# EasyEDA schematic FD-01 MK3.json
TITLE: Sheet_1; REV: 1.0; Date: 2020-09-08; Sheet: 1/1; Company: Your Company
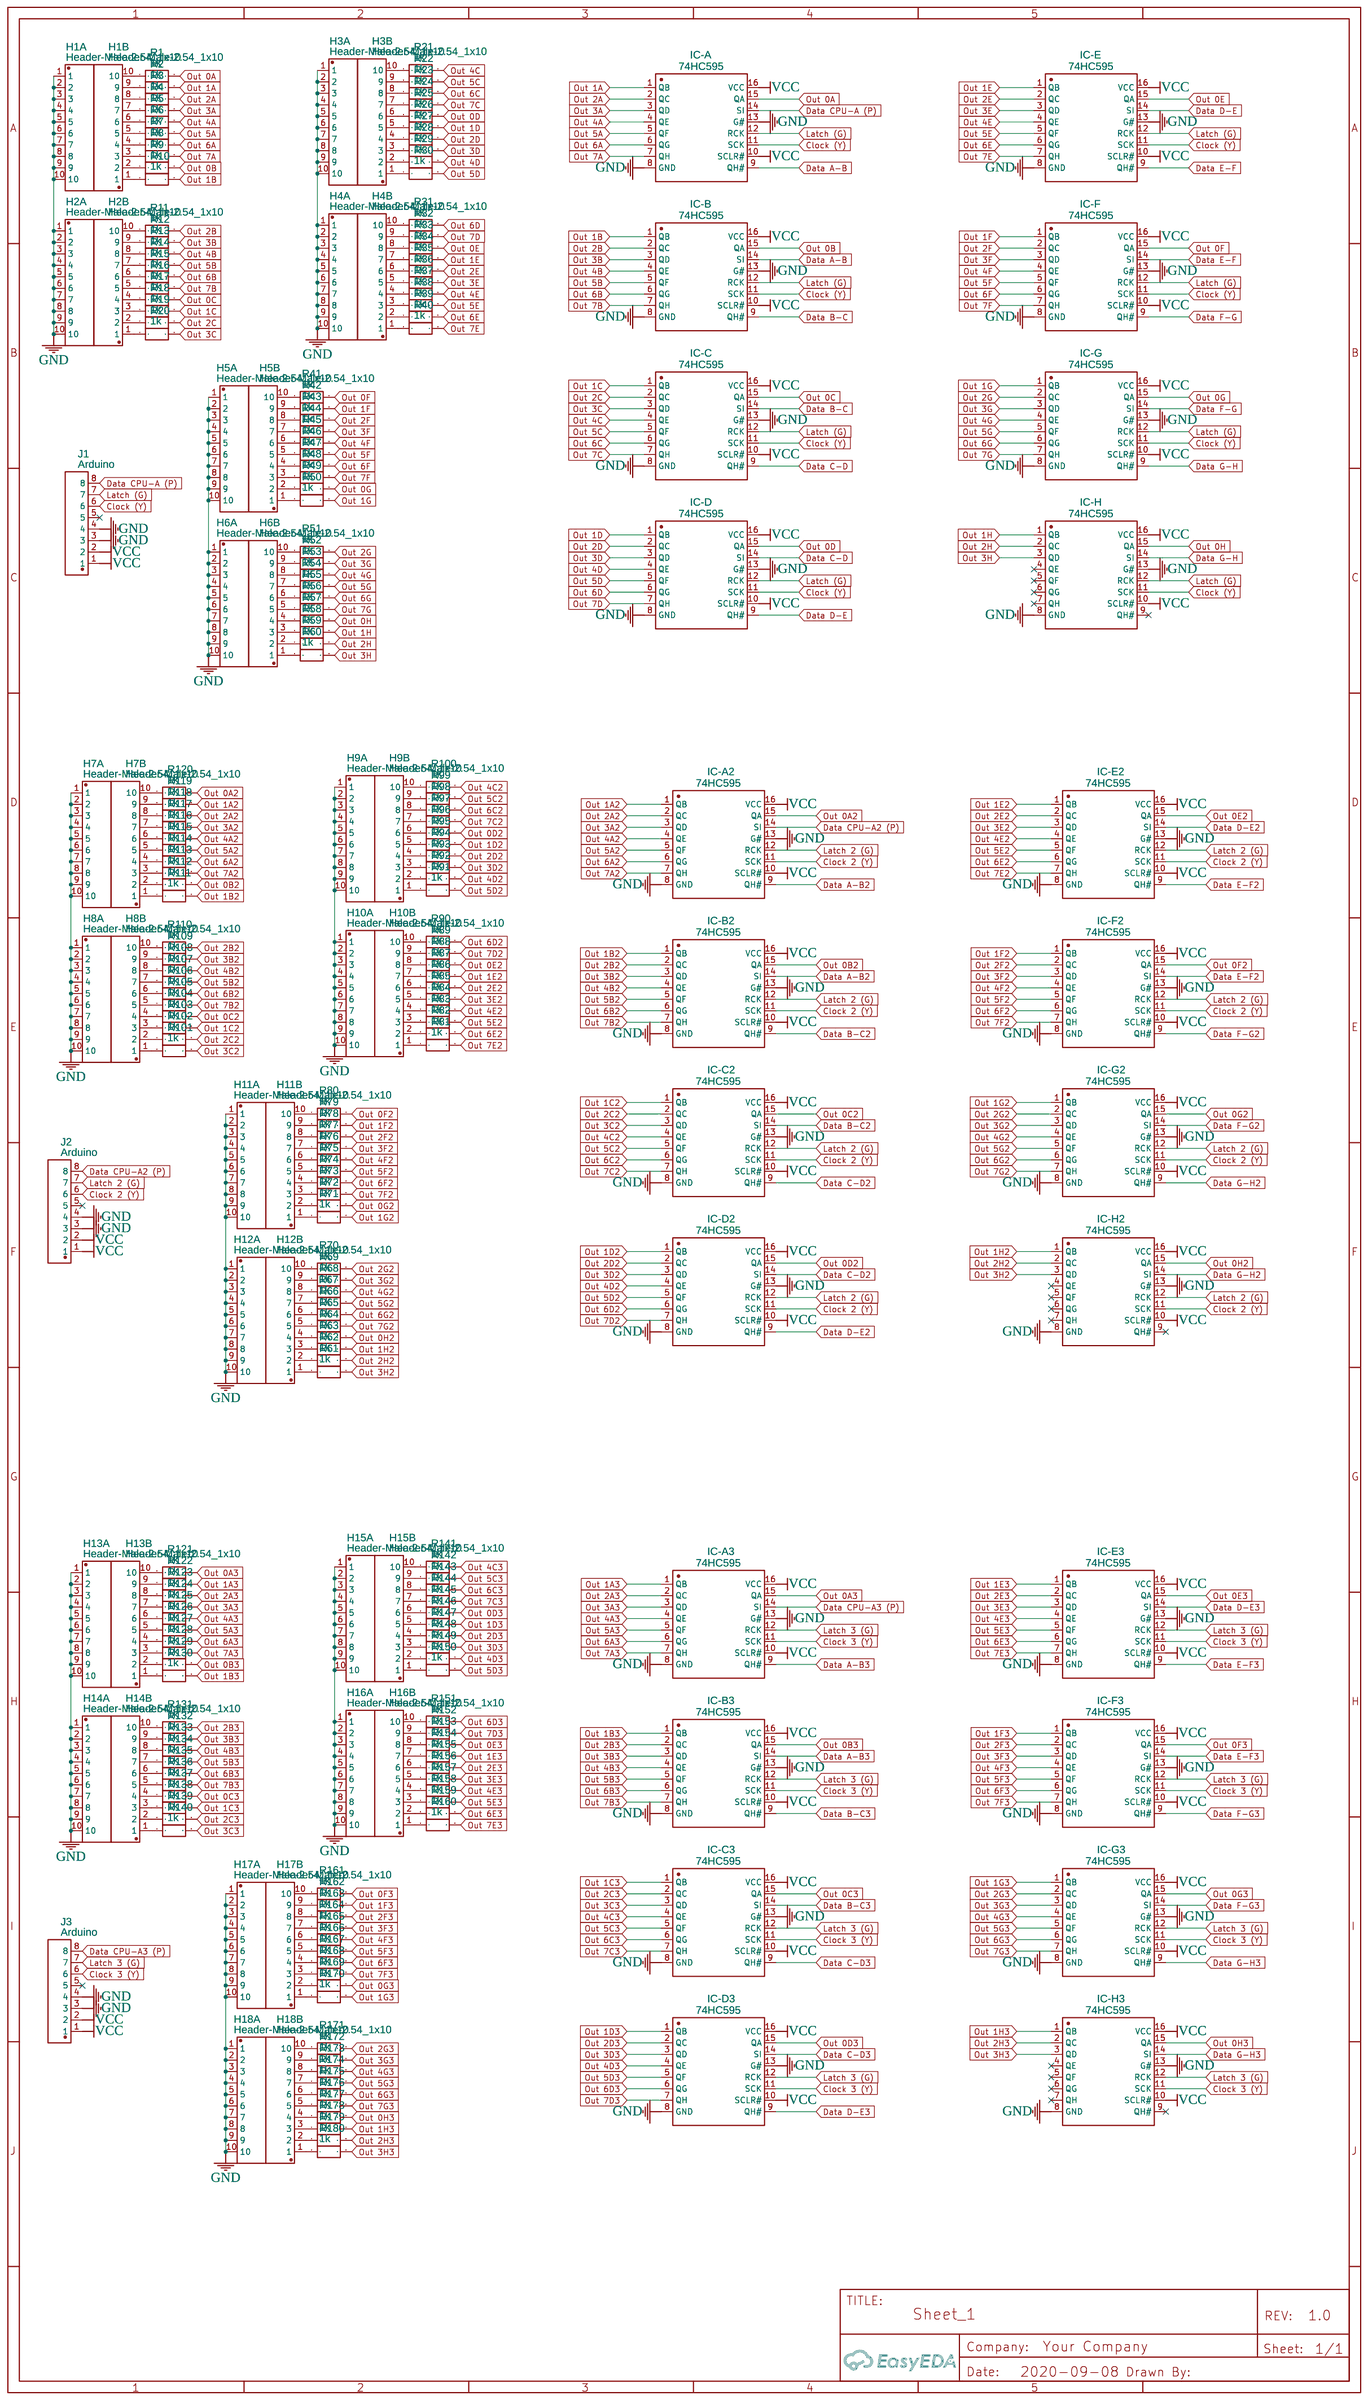
[diagram p0: schematic sheet]

## Parts
H1A  Header-Male-2.54_1x10  [HDR-TH_10P-P2.54-V]
H1B  Header-Male-2.54_1x10  [HDR-TH_10P-P2.54-V]
H2A  Header-Male-2.54_1x10  [HDR-TH_10P-P2.54-V]
H2B  Header-Male-2.54_1x10  [HDR-TH_10P-P2.54-V]
H3A  Header-Male-2.54_1x10  [HDR-TH_10P-P2.54-V]
H3B  Header-Male-2.54_1x10  [HDR-TH_10P-P2.54-V]
H4A  Header-Male-2.54_1x10  [HDR-TH_10P-P2.54-V]
H4B  Header-Male-2.54_1x10  [HDR-TH_10P-P2.54-V]
H5A  Header-Male-2.54_1x10  [HDR-TH_10P-P2.54-V]
H5B  Header-Male-2.54_1x10  [HDR-TH_10P-P2.54-V]
H6A  Header-Male-2.54_1x10  [HDR-TH_10P-P2.54-V]
H6B  Header-Male-2.54_1x10  [HDR-TH_10P-P2.54-V]
H7A  Header-Male-2.54_1x10  [HDR-TH_10P-P2.54-V]
H7B  Header-Male-2.54_1x10  [HDR-TH_10P-P2.54-V]
H8A  Header-Male-2.54_1x10  [HDR-TH_10P-P2.54-V]
H8B  Header-Male-2.54_1x10  [HDR-TH_10P-P2.54-V]
H9A  Header-Male-2.54_1x10  [HDR-TH_10P-P2.54-V]
H9B  Header-Male-2.54_1x10  [HDR-TH_10P-P2.54-V]
H10A  Header-Male-2.54_1x10  [HDR-TH_10P-P2.54-V]
H10B  Header-Male-2.54_1x10  [HDR-TH_10P-P2.54-V]
H11A  Header-Male-2.54_1x10  [HDR-TH_10P-P2.54-V]
H11B  Header-Male-2.54_1x10  [HDR-TH_10P-P2.54-V]
H12A  Header-Male-2.54_1x10  [HDR-TH_10P-P2.54-V]
H12B  Header-Male-2.54_1x10  [HDR-TH_10P-P2.54-V]
H13A  Header-Male-2.54_1x10  [HDR-TH_10P-P2.54-V]
H13B  Header-Male-2.54_1x10  [HDR-TH_10P-P2.54-V]
H14A  Header-Male-2.54_1x10  [HDR-TH_10P-P2.54-V]
H14B  Header-Male-2.54_1x10  [HDR-TH_10P-P2.54-V]
H15A  Header-Male-2.54_1x10  [HDR-TH_10P-P2.54-V]
H15B  Header-Male-2.54_1x10  [HDR-TH_10P-P2.54-V]
H16A  Header-Male-2.54_1x10  [HDR-TH_10P-P2.54-V]
H16B  Header-Male-2.54_1x10  [HDR-TH_10P-P2.54-V]
H17A  Header-Male-2.54_1x10  [HDR-TH_10P-P2.54-V]
H17B  Header-Male-2.54_1x10  [HDR-TH_10P-P2.54-V]
H18A  Header-Male-2.54_1x10  [HDR-TH_10P-P2.54-V]
H18B  Header-Male-2.54_1x10  [HDR-TH_10P-P2.54-V]
IC-A  74HC595  [SOIC-16_L9.9-W3.9-P1.27-LS6.0-BL]
IC-A2  74HC595  [SOIC-16_L9.9-W3.9-P1.27-LS6.0-BL]
IC-A3  74HC595  [SOIC-16_L9.9-W3.9-P1.27-LS6.0-BL]
IC-B  74HC595  [SOIC-16_L9.9-W3.9-P1.27-LS6.0-BL]
IC-B2  74HC595  [SOIC-16_L9.9-W3.9-P1.27-LS6.0-BL]
IC-B3  74HC595  [SOIC-16_L9.9-W3.9-P1.27-LS6.0-BL]
IC-C  74HC595  [SOIC-16_L9.9-W3.9-P1.27-LS6.0-BL]
IC-C2  74HC595  [SOIC-16_L9.9-W3.9-P1.27-LS6.0-BL]
IC-C3  74HC595  [SOIC-16_L9.9-W3.9-P1.27-LS6.0-BL]
IC-D  74HC595  [SOIC-16_L9.9-W3.9-P1.27-LS6.0-BL]
IC-D2  74HC595  [SOIC-16_L9.9-W3.9-P1.27-LS6.0-BL]
IC-D3  74HC595  [SOIC-16_L9.9-W3.9-P1.27-LS6.0-BL]
IC-E  74HC595  [SOIC-16_L9.9-W3.9-P1.27-LS6.0-BL]
IC-E2  74HC595  [SOIC-16_L9.9-W3.9-P1.27-LS6.0-BL]
IC-E3  74HC595  [SOIC-16_L9.9-W3.9-P1.27-LS6.0-BL]
IC-F  74HC595  [SOIC-16_L9.9-W3.9-P1.27-LS6.0-BL]
IC-F2  74HC595  [SOIC-16_L9.9-W3.9-P1.27-LS6.0-BL]
IC-F3  74HC595  [SOIC-16_L9.9-W3.9-P1.27-LS6.0-BL]
IC-G  74HC595  [SOIC-16_L9.9-W3.9-P1.27-LS6.0-BL]
IC-G2  74HC595  [SOIC-16_L9.9-W3.9-P1.27-LS6.0-BL]
IC-G3  74HC595  [SOIC-16_L9.9-W3.9-P1.27-LS6.0-BL]
IC-H  74HC595  [SOIC-16_L9.9-W3.9-P1.27-LS6.0-BL]
IC-H2  74HC595  [SOIC-16_L9.9-W3.9-P1.27-LS6.0-BL]
IC-H3  74HC595  [SOIC-16_L9.9-W3.9-P1.27-LS6.0-BL]
J1  Arduino  [HDR-TH_8P-P2.54-V]
J2  Arduino  [HDR-TH_8P-P2.54-V]
J3  Arduino  [HDR-TH_8P-P2.54-V]
R1  1k  [R0603]
R2  1k  [R0603]
R3  1k  [R0603]
R4  1k  [R0603]
R5  1k  [R0603]
R6  1k  [R0603]
R7  1k  [R0603]
R8  1k  [R0603]
R9  1k  [R0603]
R10  1k  [R0603]
R11  1k  [R0603]
R12  1k  [R0603]
R13  1k  [R0603]
R14  1k  [R0603]
R15  1k  [R0603]
R16  1k  [R0603]
R17  1k  [R0603]
R18  1k  [R0603]
R19  1k  [R0603]
R20  1k  [R0603]
R21  1k  [R0603]
R22  1k  [R0603]
R23  1k  [R0603]
R24  1k  [R0603]
R25  1k  [R0603]
R26  1k  [R0603]
R27  1k  [R0603]
R28  1k  [R0603]
R29  1k  [R0603]
R30  1k  [R0603]
R31  1k  [R0603]
R32  1k  [R0603]
R33  1k  [R0603]
R34  1k  [R0603]
R35  1k  [R0603]
R36  1k  [R0603]
R37  1k  [R0603]
R38  1k  [R0603]
R39  1k  [R0603]
R40  1k  [R0603]
R41  1k  [R0603]
R42  1k  [R0603]
R43  1k  [R0603]
R44  1k  [R0603]
R45  1k  [R0603]
R46  1k  [R0603]
R47  1k  [R0603]
R48  1k  [R0603]
R49  1k  [R0603]
R50  1k  [R0603]
R51  1k  [R0603]
R52  1k  [R0603]
R53  1k  [R0603]
R54  1k  [R0603]
R55  1k  [R0603]
R56  1k  [R0603]
R57  1k  [R0603]
R58  1k  [R0603]
R59  1k  [R0603]
R60  1k  [R0603]
R61  1k  [R0603]
R62  1k  [R0603]
R63  1k  [R0603]
R64  1k  [R0603]
R65  1k  [R0603]
R66  1k  [R0603]
R67  1k  [R0603]
R68  1k  [R0603]
R69  1k  [R0603]
R70  1k  [R0603]
R71  1k  [R0603]
R72  1k  [R0603]
R73  1k  [R0603]
R74  1k  [R0603]
R75  1k  [R0603]
R76  1k  [R0603]
R77  1k  [R0603]
R78  1k  [R0603]
R79  1k  [R0603]
R80  1k  [R0603]
R81  1k  [R0603]
R82  1k  [R0603]
R83  1k  [R0603]
R84  1k  [R0603]
R85  1k  [R0603]
R86  1k  [R0603]
R87  1k  [R0603]
R88  1k  [R0603]
R89  1k  [R0603]
R90  1k  [R0603]
R91  1k  [R0603]
R92  1k  [R0603]
R93  1k  [R0603]
R94  1k  [R0603]
R95  1k  [R0603]
R96  1k  [R0603]
R97  1k  [R0603]
R98  1k  [R0603]
R99  1k  [R0603]
R100  1k  [R0603]
R101  1k  [R0603]
R102  1k  [R0603]
R103  1k  [R0603]
R104  1k  [R0603]
R105  1k  [R0603]
R106  1k  [R0603]
R107  1k  [R0603]
R108  1k  [R0603]
R109  1k  [R0603]
R110  1k  [R0603]
R111  1k  [R0603]
R112  1k  [R0603]
R113  1k  [R0603]
R114  1k  [R0603]
R115  1k  [R0603]
R116  1k  [R0603]
R117  1k  [R0603]
R118  1k  [R0603]
R119  1k  [R0603]
R120  1k  [R0603]
R121  1k  [R0603]
R122  1k  [R0603]
R123  1k  [R0603]
R124  1k  [R0603]
R125  1k  [R0603]
R126  1k  [R0603]
R127  1k  [R0603]
R128  1k  [R0603]
R129  1k  [R0603]
R130  1k  [R0603]
R131  1k  [R0603]
R132  1k  [R0603]
R133  1k  [R0603]
R134  1k  [R0603]
R135  1k  [R0603]
R136  1k  [R0603]
R137  1k  [R0603]
R138  1k  [R0603]
R139  1k  [R0603]
R140  1k  [R0603]
R141  1k  [R0603]
R142  1k  [R0603]
R143  1k  [R0603]
R144  1k  [R0603]
R145  1k  [R0603]
R146  1k  [R0603]
R147  1k  [R0603]
R148  1k  [R0603]
R149  1k  [R0603]
R150  1k  [R0603]
R151  1k  [R0603]
R152  1k  [R0603]
R153  1k  [R0603]
R154  1k  [R0603]
R155  1k  [R0603]
R156  1k  [R0603]
R157  1k  [R0603]
R158  1k  [R0603]
R159  1k  [R0603]
R160  1k  [R0603]
R161  1k  [R0603]
R162  1k  [R0603]
R163  1k  [R0603]
R164  1k  [R0603]
R165  1k  [R0603]
R166  1k  [R0603]
R167  1k  [R0603]
R168  1k  [R0603]
R169  1k  [R0603]
R170  1k  [R0603]
R171  1k  [R0603]
R172  1k  [R0603]
R173  1k  [R0603]
R174  1k  [R0603]
R175  1k  [R0603]
R176  1k  [R0603]
R177  1k  [R0603]
R178  1k  [R0603]
R179  1k  [R0603]
R180  1k  [R0603]

## Library data of the parts
H1A H1B H2A H2B H3A H3B H4A H4B H5A H5B H6A H6B H7A H7B H8A H8B H9A H9B H10A H10B H11A H11B H12A H12B H13A H13B H14A H14B H15A H15B H16A H16B H17A H17B H18A H18B = Header-Male-2.54_1x10: Supplier: LCSC; Manufacturer Part: Headers  Pins2.54mm1*10P; image: http://image.lceda.cn/szlcsc/C57369.jpg; Supplier Part: C57369
IC-A IC-A2 IC-A3 IC-B IC-B2 IC-B3 IC-C IC-C2 IC-C3 IC-D IC-D2 IC-D3 IC-E IC-E2 IC-E3 IC-F IC-F2 IC-F3 IC-G IC-G2 IC-G3 IC-H IC-H2 IC-H3 = 74HC595D: Supplier: LCSC; Manufacturer: FM; Supplier Part: C86609
J1-J3 = Header2.54mm 1*8P: Supplier Part: C49256; Supplier: LCSC; Manufacturer: ReliaPro; image: http://image.lceda.cn/szlcsc/C49256.jpg
R1-R180 = R_0603_EU: Contributor: LCEDA_Lib

## Nets
GND: H1A.1 H1A.2 H1A.3 H1A.4 H1A.5 H1A.6 H1A.7 H1A.8 H1A.9 H1A.10 H2A.1 H2A.2 H2A.3 H2A.4 H2A.5 H2A.6 H2A.7 H2A.8 H2A.9 H2A.10 H3A.1 H3A.2 H3A.3 H3A.4 H3A.5 H3A.6 H3A.7 H3A.8 H3A.9 H3A.10 H4A.1 H4A.2 H4A.3 H4A.4 H4A.5 H4A.6 H4A.7 H4A.8 H4A.9 H4A.10 H5A.1 H5A.2 H5A.3 H5A.4 H5A.5 H5A.6 H5A.7 H5A.8 H5A.9 H5A.10 H6A.1 H6A.2 H6A.3 H6A.4 H6A.5 H6A.6 H6A.7 H6A.8 H6A.9 H6A.10 H7A.1 H7A.2 H7A.3 H7A.4 H7A.5 H7A.6 H7A.7 H7A.8 H7A.9 H7A.10 H8A.1 H8A.2 H8A.3 H8A.4 H8A.5 H8A.6 H8A.7 H8A.8 H8A.9 H8A.10 H9A.1 H9A.2 H9A.3 H9A.4 H9A.5 H9A.6 H9A.7 H9A.8 H9A.9 H9A.10 H10A.1 H10A.2 H10A.3 H10A.4 H10A.5 H10A.6 H10A.7 H10A.8 H10A.9 H10A.10 H11A.1 H11A.2 H11A.3 H11A.4 H11A.5 H11A.6 H11A.7 H11A.8 H11A.9 H11A.10 H12A.1 H12A.2 H12A.3 H12A.4 H12A.5 H12A.6 H12A.7 H12A.8 H12A.9 H12A.10 H13A.1 H13A.2 H13A.3 H13A.4 H13A.5 H13A.6 H13A.7 H13A.8 H13A.9 H13A.10 H14A.1 H14A.2 H14A.3 H14A.4 H14A.5 H14A.6 H14A.7 H14A.8 H14A.9 H14A.10 H15A.1 H15A.2 H15A.3 H15A.4 H15A.5 H15A.6 H15A.7 H15A.8 H15A.9 H15A.10 H16A.1 H16A.2 H16A.3 H16A.4 H16A.5 H16A.6 H16A.7 H16A.8 H16A.9 H16A.10 H17A.1 H17A.2 H17A.3 H17A.4 H17A.5 H17A.6 H17A.7 H17A.8 H17A.9 H17A.10 H18A.1 H18A.2 H18A.3 H18A.4 H18A.5 H18A.6 H18A.7 H18A.8 H18A.9 H18A.10 IC-A.8(GND) IC-A.13(G#) IC-A2.8(GND) IC-A2.13(G#) IC-A3.8(GND) IC-A3.13(G#) IC-B.8(GND) IC-B.13(G#) IC-B2.8(GND) IC-B2.13(G#) IC-B3.8(GND) IC-B3.13(G#) IC-C.8(GND) IC-C.13(G#) IC-C2.8(GND) IC-C2.13(G#) IC-C3.8(GND) IC-C3.13(G#) IC-D.8(GND) IC-D.13(G#) IC-D2.8(GND) IC-D2.13(G#) IC-D3.8(GND) IC-D3.13(G#) IC-E.8(GND) IC-E.13(G#) IC-E2.8(GND) IC-E2.13(G#) IC-E3.8(GND) IC-E3.13(G#) IC-F.8(GND) IC-F.13(G#) IC-F2.8(GND) IC-F2.13(G#) IC-F3.8(GND) IC-F3.13(G#) IC-G.8(GND) IC-G.13(G#) IC-G2.8(GND) IC-G2.13(G#) IC-G3.8(GND) IC-G3.13(G#) IC-H.8(GND) IC-H.13(G#) IC-H2.8(GND) IC-H2.13(G#) IC-H3.8(GND) IC-H3.13(G#) J1.3 J1.4 J2.3 J2.4 J3.3 J3.4
VCC: IC-A.10(SCLR#) IC-A.16(VCC) IC-A2.10(SCLR#) IC-A2.16(VCC) IC-A3.10(SCLR#) IC-A3.16(VCC) IC-B.10(SCLR#) IC-B.16(VCC) IC-B2.10(SCLR#) IC-B2.16(VCC) IC-B3.10(SCLR#) IC-B3.16(VCC) IC-C.10(SCLR#) IC-C.16(VCC) IC-C2.10(SCLR#) IC-C2.16(VCC) IC-C3.10(SCLR#) IC-C3.16(VCC) IC-D.10(SCLR#) IC-D.16(VCC) IC-D2.10(SCLR#) IC-D2.16(VCC) IC-D3.10(SCLR#) IC-D3.16(VCC) IC-E.10(SCLR#) IC-E.16(VCC) IC-E2.10(SCLR#) IC-E2.16(VCC) IC-E3.10(SCLR#) IC-E3.16(VCC) IC-F.10(SCLR#) IC-F.16(VCC) IC-F2.10(SCLR#) IC-F2.16(VCC) IC-F3.10(SCLR#) IC-F3.16(VCC) IC-G.10(SCLR#) IC-G.16(VCC) IC-G2.10(SCLR#) IC-G2.16(VCC) IC-G3.10(SCLR#) IC-G3.16(VCC) IC-H.10(SCLR#) IC-H.16(VCC) IC-H2.10(SCLR#) IC-H2.16(VCC) IC-H3.10(SCLR#) IC-H3.16(VCC) J1.1 J1.2 J2.1 J2.2 J3.1 J3.2
Clock 2 (Y): IC-A2.11(SCK) IC-B2.11(SCK) IC-C2.11(SCK) IC-D2.11(SCK) IC-E2.11(SCK) IC-F2.11(SCK) IC-G2.11(SCK) IC-H2.11(SCK) J2.6
Clock 3 (Y): IC-A3.11(SCK) IC-B3.11(SCK) IC-C3.11(SCK) IC-D3.11(SCK) IC-E3.11(SCK) IC-F3.11(SCK) IC-G3.11(SCK) IC-H3.11(SCK) J3.6
Clock (Y): IC-A.11(SCK) IC-B.11(SCK) IC-C.11(SCK) IC-D.11(SCK) IC-E.11(SCK) IC-F.11(SCK) IC-G.11(SCK) IC-H.11(SCK) J1.6
Data A-B: IC-A.9(QH#) IC-B.14(SI)
Data A-B2: IC-A2.9(QH#) IC-B2.14(SI)
Data A-B3: IC-A3.9(QH#) IC-B3.14(SI)
Data B-C: IC-B.9(QH#) IC-C.14(SI)
Data B-C2: IC-B2.9(QH#) IC-C2.14(SI)
Data B-C3: IC-B3.9(QH#) IC-C3.14(SI)
Data C-D: IC-C.9(QH#) IC-D.14(SI)
Data C-D2: IC-C2.9(QH#) IC-D2.14(SI)
Data C-D3: IC-C3.9(QH#) IC-D3.14(SI)
Data CPU-A2 (P): IC-A2.14(SI) J2.8
Data CPU-A3 (P): IC-A3.14(SI) J3.8
Data CPU-A (P): IC-A.14(SI) J1.8
Data D-E: IC-D.9(QH#) IC-E.14(SI)
Data D-E2: IC-D2.9(QH#) IC-E2.14(SI)
Data D-E3: IC-D3.9(QH#) IC-E3.14(SI)
Data E-F: IC-E.9(QH#) IC-F.14(SI)
Data E-F2: IC-E2.9(QH#) IC-F2.14(SI)
Data E-F3: IC-E3.9(QH#) IC-F3.14(SI)
Data F-G: IC-F.9(QH#) IC-G.14(SI)
Data F-G2: IC-F2.9(QH#) IC-G2.14(SI)
Data F-G3: IC-F3.9(QH#) IC-G3.14(SI)
Data G-H: IC-G.9(QH#) IC-H.14(SI)
Data G-H2: IC-G2.9(QH#) IC-H2.14(SI)
Data G-H3: IC-G3.9(QH#) IC-H3.14(SI)
Latch 2 (G): IC-A2.12(RCK) IC-B2.12(RCK) IC-C2.12(RCK) IC-D2.12(RCK) IC-E2.12(RCK) IC-F2.12(RCK) IC-G2.12(RCK) IC-H2.12(RCK) J2.7
Latch 3 (G): IC-A3.12(RCK) IC-B3.12(RCK) IC-C3.12(RCK) IC-D3.12(RCK) IC-E3.12(RCK) IC-F3.12(RCK) IC-G3.12(RCK) IC-H3.12(RCK) J3.7
Latch (G): IC-A.12(RCK) IC-B.12(RCK) IC-C.12(RCK) IC-D.12(RCK) IC-E.12(RCK) IC-F.12(RCK) IC-G.12(RCK) IC-H.12(RCK) J1.7
Out 0A: IC-A.15(QA) R1.2
Out 0A2: IC-A2.15(QA) R120.2
Out 0A3: IC-A3.15(QA) R121.2
Out 0B: IC-B.15(QA) R9.2
Out 0B2: IC-B2.15(QA) R112.2
Out 0B3: IC-B3.15(QA) R129.2
Out 0C: IC-C.15(QA) R17.2
Out 0C2: IC-C2.15(QA) R104.2
Out 0C3: IC-C3.15(QA) R137.2
Out 0D: IC-D.15(QA) R25.2
Out 0D2: IC-D2.15(QA) R96.2
Out 0D3: IC-D3.15(QA) R145.2
Out 0E: IC-E.15(QA) R33.2
Out 0E2: IC-E2.15(QA) R88.2
Out 0E3: IC-E3.15(QA) R153.2
Out 0F: IC-F.15(QA) R41.2
Out 0F2: IC-F2.15(QA) R80.2
Out 0F3: IC-F3.15(QA) R161.2
Out 0G: IC-G.15(QA) R49.2
Out 0G2: IC-G2.15(QA) R72.2
Out 0G3: IC-G3.15(QA) R169.2
Out 0H: IC-H.15(QA) R57.2
Out 0H2: IC-H2.15(QA) R64.2
Out 0H3: IC-H3.15(QA) R177.2
Out 1A: IC-A.1(QB) R2.2
Out 1A2: IC-A2.1(QB) R119.2
Out 1A3: IC-A3.1(QB) R122.2
Out 1B: IC-B.1(QB) R10.2
Out 1B2: IC-B2.1(QB) R111.2
Out 1B3: IC-B3.1(QB) R130.2
Out 1C: IC-C.1(QB) R18.2
Out 1C2: IC-C2.1(QB) R103.2
Out 1C3: IC-C3.1(QB) R138.2
Out 1D: IC-D.1(QB) R26.2
Out 1D2: IC-D2.1(QB) R95.2
Out 1D3: IC-D3.1(QB) R146.2
Out 1E: IC-E.1(QB) R34.2
Out 1E2: IC-E2.1(QB) R87.2
Out 1E3: IC-E3.1(QB) R154.2
Out 1F: IC-F.1(QB) R42.2
Out 1F2: IC-F2.1(QB) R79.2
Out 1F3: IC-F3.1(QB) R162.2
Out 1G: IC-G.1(QB) R50.2
Out 1G2: IC-G2.1(QB) R71.2
Out 1G3: IC-G3.1(QB) R170.2
Out 1H: IC-H.1(QB) R58.2
Out 1H2: IC-H2.1(QB) R63.2
Out 1H3: IC-H3.1(QB) R178.2
Out 2A: IC-A.2(QC) R3.2
Out 2A2: IC-A2.2(QC) R118.2
Out 2A3: IC-A3.2(QC) R123.2
Out 2B: IC-B.2(QC) R11.2
Out 2B2: IC-B2.2(QC) R110.2
Out 2B3: IC-B3.2(QC) R131.2
Out 2C: IC-C.2(QC) R19.2
Out 2C2: IC-C2.2(QC) R102.2
Out 2C3: IC-C3.2(QC) R139.2
Out 2D: IC-D.2(QC) R27.2
Out 2D2: IC-D2.2(QC) R94.2
Out 2D3: IC-D3.2(QC) R147.2
Out 2E: IC-E.2(QC) R35.2
Out 2E2: IC-E2.2(QC) R86.2
Out 2E3: IC-E3.2(QC) R155.2
Out 2F: IC-F.2(QC) R43.2
Out 2F2: IC-F2.2(QC) R78.2
Out 2F3: IC-F3.2(QC) R163.2
Out 2G: IC-G.2(QC) R51.2
Out 2G2: IC-G2.2(QC) R70.2
Out 2G3: IC-G3.2(QC) R171.2
Out 2H: IC-H.2(QC) R59.2
Out 2H2: IC-H2.2(QC) R62.2
Out 2H3: IC-H3.2(QC) R179.2
Out 3A: IC-A.3(QD) R4.2
Out 3A2: IC-A2.3(QD) R117.2
Out 3A3: IC-A3.3(QD) R124.2
Out 3B: IC-B.3(QD) R12.2
Out 3B2: IC-B2.3(QD) R109.2
Out 3B3: IC-B3.3(QD) R132.2
Out 3C: IC-C.3(QD) R20.2
Out 3C2: IC-C2.3(QD) R101.2
Out 3C3: IC-C3.3(QD) R140.2
Out 3D: IC-D.3(QD) R28.2
Out 3D2: IC-D2.3(QD) R93.2
Out 3D3: IC-D3.3(QD) R148.2
Out 3E: IC-E.3(QD) R36.2
Out 3E2: IC-E2.3(QD) R85.2
Out 3E3: IC-E3.3(QD) R156.2
Out 3F: IC-F.3(QD) R44.2
Out 3F2: IC-F2.3(QD) R77.2
Out 3F3: IC-F3.3(QD) R164.2
Out 3G: IC-G.3(QD) R52.2
Out 3G2: IC-G2.3(QD) R69.2
Out 3G3: IC-G3.3(QD) R172.2
Out 3H: IC-H.3(QD) R60.2
Out 3H2: IC-H2.3(QD) R61.2
Out 3H3: IC-H3.3(QD) R180.2
Out 4A: IC-A.4(QE) R5.2
Out 4A2: IC-A2.4(QE) R116.2
Out 4A3: IC-A3.4(QE) R125.2
Out 4B: IC-B.4(QE) R13.2
Out 4B2: IC-B2.4(QE) R108.2
Out 4B3: IC-B3.4(QE) R133.2
Out 4C: IC-C.4(QE) R21.2
Out 4C2: IC-C2.4(QE) R100.2
Out 4C3: IC-C3.4(QE) R141.2
Out 4D: IC-D.4(QE) R29.2
Out 4D2: IC-D2.4(QE) R92.2
Out 4D3: IC-D3.4(QE) R149.2
Out 4E: IC-E.4(QE) R37.2
Out 4E2: IC-E2.4(QE) R84.2
Out 4E3: IC-E3.4(QE) R157.2
Out 4F: IC-F.4(QE) R45.2
Out 4F2: IC-F2.4(QE) R76.2
Out 4F3: IC-F3.4(QE) R165.2
Out 4G: IC-G.4(QE) R53.2
Out 4G2: IC-G2.4(QE) R68.2
Out 4G3: IC-G3.4(QE) R173.2
Out 5A: IC-A.5(QF) R6.2
Out 5A2: IC-A2.5(QF) R115.2
Out 5A3: IC-A3.5(QF) R126.2
Out 5B: IC-B.5(QF) R14.2
Out 5B2: IC-B2.5(QF) R107.2
Out 5B3: IC-B3.5(QF) R134.2
Out 5C: IC-C.5(QF) R22.2
Out 5C2: IC-C2.5(QF) R99.2
Out 5C3: IC-C3.5(QF) R142.2
Out 5D: IC-D.5(QF) R30.2
Out 5D2: IC-D2.5(QF) R91.2
Out 5D3: IC-D3.5(QF) R150.2
Out 5E: IC-E.5(QF) R38.2
Out 5E2: IC-E2.5(QF) R83.2
Out 5E3: IC-E3.5(QF) R158.2
Out 5F: IC-F.5(QF) R46.2
Out 5F2: IC-F2.5(QF) R75.2
Out 5F3: IC-F3.5(QF) R166.2
Out 5G: IC-G.5(QF) R54.2
Out 5G2: IC-G2.5(QF) R67.2
Out 5G3: IC-G3.5(QF) R174.2
Out 6A: IC-A.6(QG) R7.2
Out 6A2: IC-A2.6(QG) R114.2
Out 6A3: IC-A3.6(QG) R127.2
Out 6B: IC-B.6(QG) R15.2
Out 6B2: IC-B2.6(QG) R106.2
Out 6B3: IC-B3.6(QG) R135.2
Out 6C: IC-C.6(QG) R23.2
Out 6C2: IC-C2.6(QG) R98.2
Out 6C3: IC-C3.6(QG) R143.2
Out 6D: IC-D.6(QG) R31.2
Out 6D2: IC-D2.6(QG) R90.2
Out 6D3: IC-D3.6(QG) R151.2
Out 6E: IC-E.6(QG) R39.2
Out 6E2: IC-E2.6(QG) R82.2
Out 6E3: IC-E3.6(QG) R159.2
Out 6F: IC-F.6(QG) R47.2
Out 6F2: IC-F2.6(QG) R74.2
Out 6F3: IC-F3.6(QG) R167.2
Out 6G: IC-G.6(QG) R55.2
Out 6G2: IC-G2.6(QG) R66.2
Out 6G3: IC-G3.6(QG) R175.2
Out 7A: IC-A.7(QH) R8.2
Out 7A2: IC-A2.7(QH) R113.2
Out 7A3: IC-A3.7(QH) R128.2
Out 7B: IC-B.7(QH) R16.2
Out 7B2: IC-B2.7(QH) R105.2
Out 7B3: IC-B3.7(QH) R136.2
Out 7C: IC-C.7(QH) R24.2
Out 7C2: IC-C2.7(QH) R97.2
Out 7C3: IC-C3.7(QH) R144.2
Out 7D: IC-D.7(QH) R32.2
Out 7D2: IC-D2.7(QH) R89.2
Out 7D3: IC-D3.7(QH) R152.2
Out 7E: IC-E.7(QH) R40.2
Out 7E2: IC-E2.7(QH) R81.2
Out 7E3: IC-E3.7(QH) R160.2
Out 7F: IC-F.7(QH) R48.2
Out 7F2: IC-F2.7(QH) R73.2
Out 7F3: IC-F3.7(QH) R168.2
Out 7G: IC-G.7(QH) R56.2
Out 7G2: IC-G2.7(QH) R65.2
Out 7G3: IC-G3.7(QH) R176.2
Net-(H1B-1): H1B.1 R10.1
Net-(H1B-2): H1B.2 R9.1
Net-(H1B-3): H1B.3 R8.1
Net-(H1B-4): H1B.4 R7.1
Net-(H1B-5): H1B.5 R6.1
Net-(H1B-6): H1B.6 R5.1
Net-(H1B-7): H1B.7 R4.1
Net-(H1B-8): H1B.8 R3.1
Net-(H1B-9): H1B.9 R2.1
Net-(H1B-10): H1B.10 R1.1
Net-(H2B-1): H2B.1 R20.1
Net-(H2B-2): H2B.2 R19.1
Net-(H2B-3): H2B.3 R18.1
Net-(H2B-4): H2B.4 R17.1
Net-(H2B-5): H2B.5 R16.1
Net-(H2B-6): H2B.6 R15.1
Net-(H2B-7): H2B.7 R14.1
Net-(H2B-8): H2B.8 R13.1
Net-(H2B-9): H2B.9 R12.1
Net-(H2B-10): H2B.10 R11.1
Net-(H3B-1): H3B.1 R30.1
Net-(H3B-2): H3B.2 R29.1
Net-(H3B-3): H3B.3 R28.1
Net-(H3B-4): H3B.4 R27.1
Net-(H3B-5): H3B.5 R26.1
Net-(H3B-6): H3B.6 R25.1
Net-(H3B-7): H3B.7 R24.1
Net-(H3B-8): H3B.8 R23.1
Net-(H3B-9): H3B.9 R22.1
Net-(H3B-10): H3B.10 R21.1
Net-(H4B-1): H4B.1 R40.1
Net-(H4B-2): H4B.2 R39.1
Net-(H4B-3): H4B.3 R38.1
Net-(H4B-4): H4B.4 R37.1
Net-(H4B-5): H4B.5 R36.1
Net-(H4B-6): H4B.6 R35.1
Net-(H4B-7): H4B.7 R34.1
Net-(H4B-8): H4B.8 R33.1
Net-(H4B-9): H4B.9 R32.1
Net-(H4B-10): H4B.10 R31.1
Net-(H5B-1): H5B.1 R50.1
Net-(H5B-2): H5B.2 R49.1
Net-(H5B-3): H5B.3 R48.1
Net-(H5B-4): H5B.4 R47.1
Net-(H5B-5): H5B.5 R46.1
Net-(H5B-6): H5B.6 R45.1
Net-(H5B-7): H5B.7 R44.1
Net-(H5B-8): H5B.8 R43.1
Net-(H5B-9): H5B.9 R42.1
Net-(H5B-10): H5B.10 R41.1
Net-(H6B-1): H6B.1 R60.1
Net-(H6B-2): H6B.2 R59.1
Net-(H6B-3): H6B.3 R58.1
Net-(H6B-4): H6B.4 R57.1
Net-(H6B-5): H6B.5 R56.1
Net-(H6B-6): H6B.6 R55.1
Net-(H6B-7): H6B.7 R54.1
Net-(H6B-8): H6B.8 R53.1
Net-(H6B-9): H6B.9 R52.1
Net-(H6B-10): H6B.10 R51.1
Net-(H7B-1): H7B.1 R111.1
Net-(H7B-2): H7B.2 R112.1
Net-(H7B-3): H7B.3 R113.1
Net-(H7B-4): H7B.4 R114.1
Net-(H7B-5): H7B.5 R115.1
Net-(H7B-6): H7B.6 R116.1
Net-(H7B-7): H7B.7 R117.1
Net-(H7B-8): H7B.8 R118.1
Net-(H7B-9): H7B.9 R119.1
Net-(H7B-10): H7B.10 R120.1
Net-(H8B-1): H8B.1 R101.1
Net-(H8B-2): H8B.2 R102.1
Net-(H8B-3): H8B.3 R103.1
Net-(H8B-4): H8B.4 R104.1
Net-(H8B-5): H8B.5 R105.1
Net-(H8B-6): H8B.6 R106.1
Net-(H8B-7): H8B.7 R107.1
Net-(H8B-8): H8B.8 R108.1
Net-(H8B-9): H8B.9 R109.1
Net-(H8B-10): H8B.10 R110.1
Net-(H9B-1): H9B.1 R91.1
Net-(H9B-2): H9B.2 R92.1
Net-(H9B-3): H9B.3 R93.1
Net-(H9B-4): H9B.4 R94.1
Net-(H9B-5): H9B.5 R95.1
Net-(H9B-6): H9B.6 R96.1
Net-(H9B-7): H9B.7 R97.1
Net-(H9B-8): H9B.8 R98.1
Net-(H9B-9): H9B.9 R99.1
Net-(H9B-10): H9B.10 R100.1
Net-(H10B-1): H10B.1 R81.1
Net-(H10B-2): H10B.2 R82.1
Net-(H10B-3): H10B.3 R83.1
Net-(H10B-4): H10B.4 R84.1
Net-(H10B-5): H10B.5 R85.1
Net-(H10B-6): H10B.6 R86.1
Net-(H10B-7): H10B.7 R87.1
Net-(H10B-8): H10B.8 R88.1
Net-(H10B-9): H10B.9 R89.1
Net-(H10B-10): H10B.10 R90.1
Net-(H11B-1): H11B.1 R71.1
Net-(H11B-2): H11B.2 R72.1
Net-(H11B-3): H11B.3 R73.1
Net-(H11B-4): H11B.4 R74.1
Net-(H11B-5): H11B.5 R75.1
Net-(H11B-6): H11B.6 R76.1
Net-(H11B-7): H11B.7 R77.1
Net-(H11B-8): H11B.8 R78.1
Net-(H11B-9): H11B.9 R79.1
Net-(H11B-10): H11B.10 R80.1
Net-(H12B-1): H12B.1 R61.1
Net-(H12B-2): H12B.2 R62.1
Net-(H12B-3): H12B.3 R63.1
Net-(H12B-4): H12B.4 R64.1
Net-(H12B-5): H12B.5 R65.1
Net-(H12B-6): H12B.6 R66.1
Net-(H12B-7): H12B.7 R67.1
Net-(H12B-8): H12B.8 R68.1
Net-(H12B-9): H12B.9 R69.1
Net-(H12B-10): H12B.10 R70.1
Net-(H13B-1): H13B.1 R130.1
Net-(H13B-2): H13B.2 R129.1
Net-(H13B-3): H13B.3 R128.1
Net-(H13B-4): H13B.4 R127.1
Net-(H13B-5): H13B.5 R126.1
Net-(H13B-6): H13B.6 R125.1
Net-(H13B-7): H13B.7 R124.1
Net-(H13B-8): H13B.8 R123.1
Net-(H13B-9): H13B.9 R122.1
Net-(H13B-10): H13B.10 R121.1
Net-(H14B-1): H14B.1 R140.1
Net-(H14B-2): H14B.2 R139.1
Net-(H14B-3): H14B.3 R138.1
Net-(H14B-4): H14B.4 R137.1
Net-(H14B-5): H14B.5 R136.1
Net-(H14B-6): H14B.6 R135.1
Net-(H14B-7): H14B.7 R134.1
Net-(H14B-8): H14B.8 R133.1
Net-(H14B-9): H14B.9 R132.1
Net-(H14B-10): H14B.10 R131.1
Net-(H15B-1): H15B.1 R150.1
Net-(H15B-2): H15B.2 R149.1
Net-(H15B-3): H15B.3 R148.1
Net-(H15B-4): H15B.4 R147.1
Net-(H15B-5): H15B.5 R146.1
Net-(H15B-6): H15B.6 R145.1
Net-(H15B-7): H15B.7 R144.1
Net-(H15B-8): H15B.8 R143.1
Net-(H15B-9): H15B.9 R142.1
Net-(H15B-10): H15B.10 R141.1
Net-(H16B-1): H16B.1 R160.1
Net-(H16B-2): H16B.2 R159.1
Net-(H16B-3): H16B.3 R158.1
Net-(H16B-4): H16B.4 R157.1
Net-(H16B-5): H16B.5 R156.1
Net-(H16B-6): H16B.6 R155.1
Net-(H16B-7): H16B.7 R154.1
Net-(H16B-8): H16B.8 R153.1
Net-(H16B-9): H16B.9 R152.1
Net-(H16B-10): H16B.10 R151.1
Net-(H17B-1): H17B.1 R170.1
Net-(H17B-2): H17B.2 R169.1
Net-(H17B-3): H17B.3 R168.1
Net-(H17B-4): H17B.4 R167.1
Net-(H17B-5): H17B.5 R166.1
Net-(H17B-6): H17B.6 R165.1
Net-(H17B-7): H17B.7 R164.1
Net-(H17B-8): H17B.8 R163.1
Net-(H17B-9): H17B.9 R162.1
Net-(H17B-10): H17B.10 R161.1
Net-(H18B-1): H18B.1 R180.1
Net-(H18B-2): H18B.2 R179.1
Net-(H18B-3): H18B.3 R178.1
Net-(H18B-4): H18B.4 R177.1
Net-(H18B-5): H18B.5 R176.1
Net-(H18B-6): H18B.6 R175.1
Net-(H18B-7): H18B.7 R174.1
Net-(H18B-8): H18B.8 R173.1
Net-(H18B-9): H18B.9 R172.1
Net-(H18B-10): H18B.10 R171.1

Not connected (* = marked no-connect by the designer): IC-H 4(QE)* 5(QF)* 6(QG)* 7(QH)* 9(QH#)*; IC-H2 4(QE)* 5(QF)* 6(QG)* 7(QH)* 9(QH#)*; IC-H3 4(QE)* 5(QF)* 6(QG)* 7(QH)* 9(QH#)*; J1 5*; J2 5*; J3 5*
